# Altium schematic sheet 02 ZYNQ_PS-BANK500-501.SchDoc
size A4
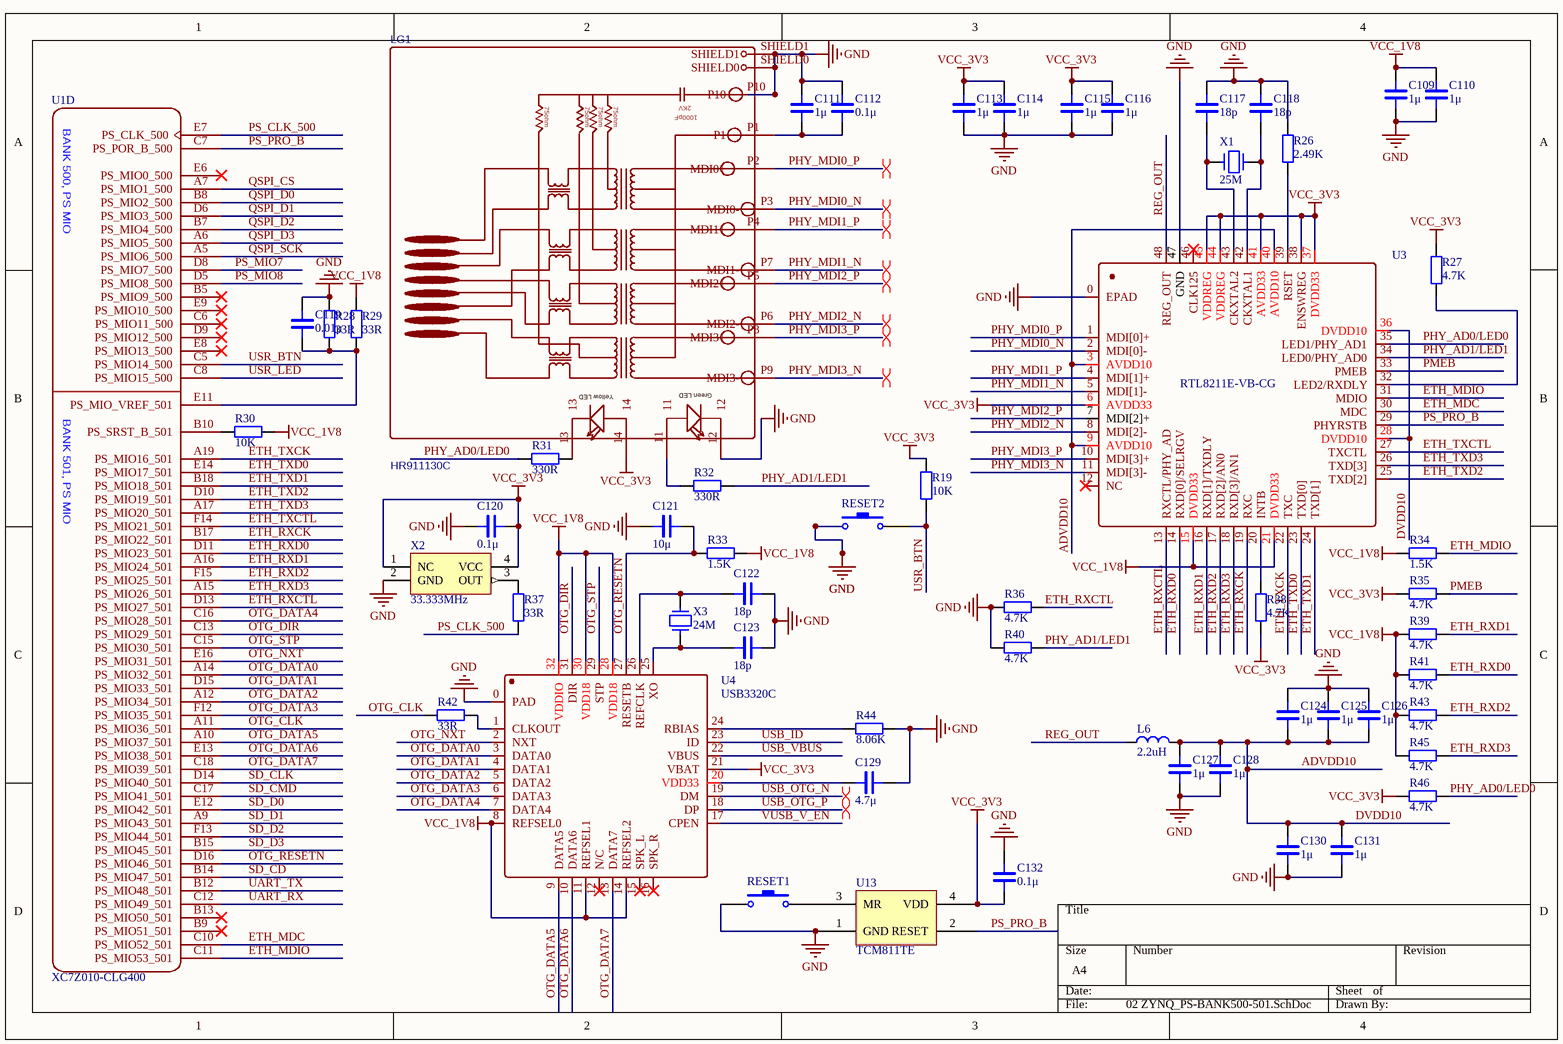
[diagram p0: 02 ZYNQ_PS-BANK500-501.SchDoc]

## Parts
C109  1μ  [LC-0402_C]
C110  1μ  [LC-0402_C]
C111  1μ  [LC-0402_C]
C112  0.1μ  [LC-0402_C]
C113  1μ  [LC-0402_C]
C114  1μ  [LC-0402_C]
C115  1μ  [LC-0402_C]
C116  1μ  [LC-0402_C]
C117  18p  [LC-0402_C]
C118  18p  [LC-0402_C]
C119  0.01μ  [LC-0402_C]
C120  0.1μ  [LC-0402_C]
C121  10μ  [LC-0402_C]
C122  18p  [LC-0402_C]
C123  18p  [LC-0402_C]
C124  1μ  [LC-0402_C]
C125  1μ  [LC-0402_C]
C126  1μ  [LC-0402_C]
C127  1μ  [LC-0402_C]
C128  1μ  [LC-0402_C]
C129  4.7μ  [LC-0402_C]
C130  1μ  [LC-0402_C]
C131  1μ  [LC-0402_C]
C132  0.1μ  [LC-0402_C]
L6  2.2uH  [L1008]
LG1  HR911130C  [HR911130C]
R19  10K  [LC-0402_R]
R26  2.49K  [LC-0402_R]
R27  4.7K  [LC-0402_R]
R28  33R  [LC-0402_R]
R29  33R  [LC-0402_R]
R30  10K  [LC-0402_R]
R31  330R  [LC-0402_R]
R32  330R  [LC-0402_R]
R33  1.5K  [LC-0402_R]
R34  1.5K  [LC-0402_R]
R35  4.7K  [LC-0402_R]
R36  4.7K  [LC-0402_R]
R37  33R  [LC-0402_R]
R38  4.7K  [LC-0402_R]
R39  4.7K  [LC-0402_R]
R40  4.7K  [LC-0402_R]
R41  4.7K  [LC-0402_R]
R42  33R  [LC-0402_R]
R43  4.7K  [LC-0402_R]
R44  8.06K  [LC-0402_R]
R45  4.7K  [LC-0402_R]
R46  4.7K  [LC-0402_R]
RESET1  SW-PB  [开关]  (value not drawn)
RESET2  SW-PB  [开关]  (value not drawn)
U1  XC7Z010-CLG400  [CLG400-0.8]  (part D of 8)
U3  RTL8211E-VB-CG  [LC-QFN-48_6x6x04P]
U4  USB3320C  [LC-QFN-32_5x5x05P]
U13  TCM811TE  [TCM811TERCTR]
X1  25M  [LC-SMD-5032_2P]
X2  33.333MHz  [OSC-SMD_4P-L3.2-W2.5-BL]
X3  24M  [LC-SMD-5032_2P]

## Nets
GND: C109.1 C110.1 C111.2 C112.2 C113.1 C114.1 C115.1 C116.1 C117.2 C118.2 C119.1 C120.2 C121.1 C122.2 C123.2 C124.2 C125.2 C126.2 C127.1 C128.1 C129.2 C130.1 C131.1 C132.2 LG1.12 LG1.P10 LG1.SHIELD0 LG1.SHIELD1 R26.2 R28.2 R36.1 R40.1 R44.2 RESET1.1 RESET2.1 U3.0(EPAD) U3.47(GND) U4.0(PAD) U13.1(GND) X2.2(GND)
VCC_1V8: C109.2 C110.2 R29.2 R30.1 R33.2 R34.1 R39.2 R41.2 R43.2 R45.2 U3.15(DVDD33) U3.21(DVDD33) U4.8(REFSEL0) U4.11(REFSEL1) U4.14(REFSEL2) U4.28(VDD18) U4.30(VDD18) U4.32(VDDIO)
VCC_3V3: C113.2 C114.2 C115.2 C116.2 C120.1 C132.1 LG1.14 R19.1 R27.2 R35.1 R38.1 R46.1 U3.6(AVDD33) U3.37(DVDD33) U3.38(ENSWREG) U3.41(AVDD33) U3.44(VDDREG) U3.45(VDDREG) U4.21(VBAT) U13.4(VDD) X2.1(NC) X2.4(VCC)
ADVDD10: C124.1 C125.1 C126.1 C127.2 C128.2 C130.2 C131.2 L6.2 U3.3(AVDD10) U3.9(AVDD10) U3.28(DVDD10) U3.36(DVDD10) U3.40(AVDD10)  [also labelled DVDD10]
ETH_MDC: U1.C10(PS_MIO52_501) U3.30(MDC)
ETH_MDIO: R34.2 U1.C11(PS_MIO53_501) U3.31(MDIO)
ETH_RXCK: U1.B17(PS_MIO22_501) U3.19(RXC)
ETH_RXCTL: R36.2 U1.D13(PS_MIO27_501) U3.13(RXCTL/PHY_AD)
ETH_RXD0: R41.1 U1.D11(PS_MIO23_501) U3.14(RXD[0]/SELRGV)
ETH_RXD1: R39.1 U1.A16(PS_MIO24_501) U3.16(RXD[1]/TXDLY)
ETH_RXD2: R43.1 U1.F15(PS_MIO25_501) U3.17(RXD[2]/AN0)
ETH_RXD3: R45.1 U1.A15(PS_MIO26_501) U3.18(RXD[3]/AN1)
ETH_TXCK: U1.A19(PS_MIO16_501) U3.22(TXC)
ETH_TXCTL: U1.F14(PS_MIO21_501) U3.27(TXCTL)
ETH_TXD0: U1.E14(PS_MIO17_501) U3.23(TXD[0])
ETH_TXD1: U1.B18(PS_MIO18_501) U3.24(TXD[1])
ETH_TXD2: U1.D10(PS_MIO19_501) U3.25(TXD[2])
ETH_TXD3: U1.A17(PS_MIO20_501) U3.26(TXD[3])
OTG_CLK: R42.1 U1.A11(PS_MIO36_501)
OTG_DATA0: U1.A14(PS_MIO32_501) U4.3(DATA0)
OTG_DATA1: U1.D15(PS_MIO33_501) U4.4(DATA1)
OTG_DATA2: U1.A12(PS_MIO34_501) U4.5(DATA2)
OTG_DATA3: U1.F12(PS_MIO35_501) U4.6(DATA3)
OTG_DATA4: U1.C16(PS_MIO28_501) U4.7(DATA4)
OTG_DATA5: U1.A10(PS_MIO37_501) U4.9(DATA5)
OTG_DATA6: U1.E13(PS_MIO38_501) U4.10(DATA6)
OTG_DATA7: U1.C18(PS_MIO39_501) U4.13(DATA7)
OTG_DIR: U1.C13(PS_MIO29_501) U4.31(DIR)
OTG_NXT: U1.E16(PS_MIO31_501) U4.2(NXT)
OTG_RESETN: C121.2 R33.1 U1.D16(PS_MIO46_501) U4.27(RESETB)
OTG_STP: U1.C15(PS_MIO30_501) U4.29(STP)
PHY_AD0/LED0: R31.1 R46.2 U3.35(LED1/PHY_AD1)
PHY_AD1/LED1: R32.1 R40.2 U3.34(LED0/PHY_AD0)
PHY_MDI0_N: LG1.P3(MDI0-) U3.2(MDI[0]-)
PHY_MDI0_P: LG1.P2(MDI0+) U3.1(MDI[0]+)
PHY_MDI1_N: LG1.P7(MDI1-) U3.5(MDI[1]-)
PHY_MDI1_P: LG1.P4(MDI1+) U3.4(MDI[1]+)
PHY_MDI2_N: LG1.P6(MDI2-) U3.8(MDI[2]-)
PHY_MDI2_P: LG1.P5(MDI2+) U3.7(MDI[2]+)
PHY_MDI3_N: LG1.P9(MDI3-) U3.11(MDI[3]-)
PHY_MDI3_P: LG1.P8(MDI3+) U3.10(MDI[3]+)
PMEB: R35.2 U3.33(PMEB)
PS_CLK_500: R37.1 U1.E7(PS_CLK_500)
PS_MIO7: U1.D8(PS_MIO7_500)
PS_MIO8: U1.D5(PS_MIO8_500)
PS_PRO_B: U1.C7(PS_POR_B_500) U3.29(PHYRSTB) U13.2(RESET)
QSPI_CS: U1.A7(PS_MIO1_500)
QSPI_D0: U1.B8(PS_MIO2_500)
QSPI_D1: U1.D6(PS_MIO3_500)
QSPI_D2: U1.B7(PS_MIO4_500)
QSPI_D3: U1.A6(PS_MIO5_500)
QSPI_SCK: U1.A5(PS_MIO6_500)
REG_OUT: L6.1 U3.48(REG_OUT)
SD_CD: U1.B14(PS_MIO47_501)
SD_CLK: U1.D14(PS_MIO40_501)
SD_CMD: U1.C17(PS_MIO41_501)
SD_D0: U1.E12(PS_MIO42_501)
SD_D1: U1.A9(PS_MIO43_501)
SD_D2: U1.F13(PS_MIO44_501)
SD_D3: U1.B15(PS_MIO45_501)
UART_RX: U1.C12(PS_MIO49_501)
UART_TX: U1.B12(PS_MIO48_501)
USB_ID: U4.23(ID)
USB_OTG_N: U4.19(DM)
USB_OTG_P: U4.18(DP)
USB_VBUS: U4.22(VBUS)
USR_BTN: R19.2 RESET2.2 U1.C5(PS_MIO14_500)
USR_LED: U1.C8(PS_MIO15_500)
VUSB_V_EN: U4.17(CPEN)
NetC111_1: C111.1 C112.1 LG1.P1
NetC117_1: C117.1 U3.43(CKXTAL2) X1.1
NetC118_1: C118.1 U3.42(CKXTAL1) X1.2
NetC119_2: C119.2 R28.1 R29.1 U1.E11(PS_MIO_VREF_501)
NetC122_1: C122.1 U4.26(REFCLK) X3.1
NetC123_1: C123.1 U4.25(XO) X3.2
NetC129_1: C129.1 U4.20(VDD33)
NetLG1_11: LG1.11 R32.2
NetLG1_13: LG1.13 R31.2
NetR26_1: R26.1 U3.39(RSET)
NetR27_1: R27.1 U3.32(LED2/RXDLY)
NetR30_2: R30.2 U1.B10(PS_SRST_B_501)
NetR37_2: R37.2 X2.3(OUT)
NetR38_2: R38.2 U3.20(INTB)
NetR42_2: R42.2 U4.1(CLKOUT)
NetR44_1: R44.1 U4.24(RBIAS)
NetRESET1_2: RESET1.2 U13.3(MR)

Not connected (* = marked no-connect by the designer): U1 B5(PS_MIO9_500)* B9(PS_MIO51_501)* B13(PS_MIO50_501)* C6(PS_MIO11_500)* D9(PS_MIO12_500)* E6(PS_MIO0_500)* E8(PS_MIO13_500)* E9(PS_MIO10_500)*; U3 12(NC)* 46(CLK125)*; U4 12(N/C)* 15(SPK_L)* 16(SPK_R)*

## Layout directives
differential pair: PHY_MDI0_N, PHY_MDI0_P, PHY_MDI1_N, PHY_MDI1_P, PHY_MDI2_N, PHY_MDI2_P, PHY_MDI3_N, PHY_MDI3_P, USB_OTG_N, USB_OTG_P

## Notes on the sheet
- (in symbol HR911130C) 2KV; 75ohm; 1000pF; J1 TX+; J2 TX-; J3 RX+; J4; J5; J6 RX-; J7; J8; Yellow LED; Green LED
- (in symbol XC7Z010-CLG400, part D) BANK 500, PS MIO; BANK 501, PS MIO

## Library data of the parts
C109-C116 C119-C121 C124-C132 = CAP_2: Capacitor
C117 C118 C122 C123 = CAP_1: Capacitor
L6 = INDUCTANCE_1: Inductance
LG1 = HR911130C: BOM_Manufacturer: HANRUN; nameAlias: Value; Contributor: LCSC; BOM_Supplier: LCSC; BOM_Manufacturer Part: HR911130C; BOM_Supplier Part: C50933; spicePre: L; spiceSymbolName: HR911130C
R19 R26-R46 = RES: Resistor
RESET1 RESET2 = SW-PB: Switch; Published: 24-Mar-1999; LatestRevisionDate: 17-Jul-2002; LatestRevisionNote: Re-released for DXP Platform.; PackageReference: SPST-2; Publisher: Altium Limited; PackageDescription: Switch; 2 Leads
X1 X3 = XTAL-2: Crystal
X2 = XTAL-4: Oscillator